# EAGLE design Adafruit_MAX31855 v2 (EAGLE 6.3)
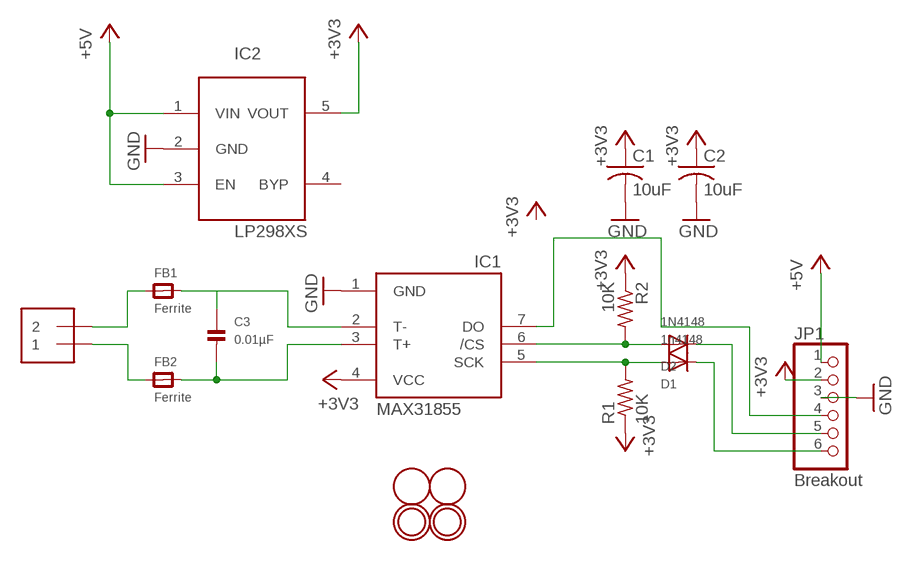
[diagram p0: schematic, sheet 1]

## Parts
C1  10uF  C-USC0805K  [C0805K]
C2  10uF  C-USC0805K  [C0805K]
C3  0.01µF  CAP_CERAMIC_0805  [_0805]
D1  1n4148  DIODESOD-323F  [SOD-323F]
D2  1N4148  DIODESOD-323F  [SOD-323F]
FB1  Ferrite  FERRITE_0805  [_0805]
FB2  Ferrite  FERRITE_0805  [_0805]
IC1  MAX31855  MAX6675  [SO08]
IC2  LP298XS  [SOT23-5L]
J1  1X2-3.5MM  [1X2-3.5MM]
JP1  Breakout  HEADER-1X676MIL  [1X06_ROUND_76]
R1  10K  R-US_R0805  [R0805]
R2  10K  R-US_R0805  [R0805]
U$1  FIDUCIAL  [FIDUCIAL_1MM]
U$2  FIDUCIAL  [FIDUCIAL_1MM]
U$4  MOUNTINGHOLE2.0  [MOUNTINGHOLE_2.0_PLATED]
U$5  MOUNTINGHOLE2.0  [MOUNTINGHOLE_2.0_PLATED]

## Nets
+3V3: C1.1 C2.1 IC1.4(VCC) IC2.5(VOUT) JP1.2 R1.1 R2.1
+5V: IC2.1(VIN) IC2.3(EN) JP1.1
CS: D2.A IC1.6(/CS) R2.2
DO: IC1.7(DO) JP1.4
GND: C1.2 C2.2 IC1.1(GND) IC2.2(GND) JP1.3
N$1: FB1.1 J1.2
N$2: D2.C JP1.5
N$3: D1.C JP1.6
N$4: C3.1 FB1.2 IC1.2(T-)
N$5: FB2.1 J1.1
N$6: C3.2 FB2.2 IC1.3(T+)
SCK: D1.A IC1.5(SCK) R1.2
Unconnected: IC2.4(BYP)

## Library data of the parts
C1 C2 = adafruit:C-US: CAPACITOR, American symbol
C3 = microbuilder:CAP_CERAMIC: Ceramic Capacitors 0402 - 0402 Surface Mount Capacitors 16pF 50V 5% [Digikey: 445-4899-2-ND] 18pF 50V 5% [Digikey: 490-1281-2-ND] 22pF 50V 5% [Digikey: 490-1283-2-ND] 68pF 50V 5% [Digikey: 490-1289-2-ND] 0.1uF 10V 10% [Digikey: 490-1318-2-ND] 1.0uF 6.3V 10% [Digikey: 490-1320-2-ND] 0603 - 0603 Surface Mount Capacitors 16 pF 50V 5% [Digikey: 445-5051-2-ND] 22 pF 50V [Digikey: PCC220ACVTR-ND] 33 pF 50V 5% [Digikey: 490-1415-1-ND] 56pF 50V 5% [Digikey: 490-1421-1-ND] 220pF 50V 5% [Digikey: 445-1285-1-ND] 680 pF 50V 2200 pF 50V 5% C0G [Digikey: 445-1297-1-ND] 5600 pF 100V 5% X7R [Digikey: 478-3711-1-ND] 0.1 µF 25V 10% [Digikey: PCC2277TR-ND] 0.22 µF 16V 10% X7R [Digikey: 445-1318-1-ND] 1.0 µF 25V 10% [Digikey: 445-5146-2-ND] 0603 - RF Specific 3pF 250V +/-0.1pF RF [Digikey: 712-1347-1-ND] 18 pF 250V 5% [Digikey: 478-3505-1-ND or 712-1322-1-ND] 56 pF 250V 5% C0G RF [Digikey: 490-4867-1-ND] 68 pF 250V RF [Digikey: 490-4868-1-ND] 0805 - 0805 Surface Mount Capacitors 220 pF 250V 2% RF Ceramic Capacitor [Digikey: 712-1398-1-ND] 1000 pF 50V 2% NP0 Ceramic Capacitor [Digikey: 478-3760-1-ND] 0.1 µF 25V 10% Ceramic Capacitor [Digikey: PCC1828TR-ND] 1.0 µF 16V 10% Ceramic Capacitor[Digikey: 490-1691-2-ND] 10.0 µF 10V 10% Ceramic Capacitor[Digikey: 709-1228-1-ND] 10.0 uF 16V 10% Ceramic Capacitor [Digikey: 478-5165-2-ND] 47 uF 6.3V 20% Ceramic Capacitor [Digikey: 587-1779-1-ND or 399-5506-1-ND] 1206 - 1206 Surface Mount Capacitors 47uF 10V 20% Ceramic Capacitor [Digikey: 490-5528-1-ND or 399-5508-1-ND or 445-6010-1-ND] 100uF 6.3V -20%, +80% Y5V Ceramic Capacitor (Digikey: 490-4512-1-ND, Mouser: 81-GRM31CF50J107ZE1L)
D1 D2 = adafruit:DIODE: Diode SMADIODE - SMA Surface Mount Package 20V 1A Schottky Diode Digikey: 641-1014-6-ND DO-1N4148 - Through Hole Small Current Diode SOD-123 20V 1 A (.5mV Vf) Schottky Diode - Digikey: MBRX120TPMSCT-ND SOD-323 10V 570mA (.38mV Vf, 3ns) Schottky Diode - Digikey: ZLLS410CT-ND SOD-523 30V 30mA Schottky Diode (RB751S-40TE61) - Digikey: RB751S-40TE61CT-ND SOT23-R/W - SOT23 Package (R = Solder Paste/Reflow Ovens, W = Hand-Soldering) BAT54Film 40V 300mA - Digikey: 497-7162-1-ND
FB1 FB2 = microbuilder:FERRITE: Ferrite Bead 0603 MMZ1608B121C - 120 Ohm @ 100MHz, 600mA, 0.15 Ohm DC Resistance - Digikey: 445-2164-1-ND BK1608HW121-T - 120 Ohm, 600mA Ferrite Chip - Digikey: 587-1876-2-ND 0805 HZ0805B272R-10 - 2.7K Ohm @ 100MHz, 200mA, 0.8 Ohm DC Resistance - Digikey: 240-2504-1-ND (see also Murata BLM21BD272SN1L) MMZ2012Y152B - 1.5K Ohm @ 100MHz, 500mA, 0.4 Ohm DC Resistance - Digikey: 445-1560-1-ND - Mainly for high frequency (80-400MHz) MMZ2012R102A - 1K Ohm @ 100MHz, 500mA, 0.3 Ohm DC Resistance - Digikey: 445-1555-2-ND - More general purpose (10-200MHz)
IC1 = adafruit:MAX6675
IC2 = adafruit:LP298X
J1 = adafruit:1X2: 3.5mm Terminal block http://www.ladyada.net/library/pcb/eaglelibrary.html
JP1 = microbuilder:HEADER-1X6: PIN HEADER
R1 R2 = adafruit:R-US_: RESISTOR, American symbol
U$1 U$2 = adafruit:FIDUCIAL: For use by pick and place machines to calibrate the vision/machine, 1mm By microbuilder.eu
U$4 U$5 = microbuilder:MOUNTINGHOLE: Mounting Hole

## Board
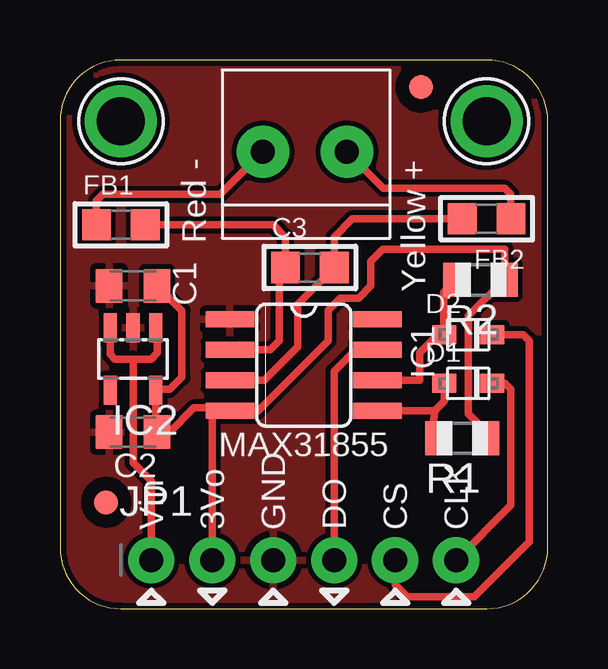
[diagram p1: board, top side]
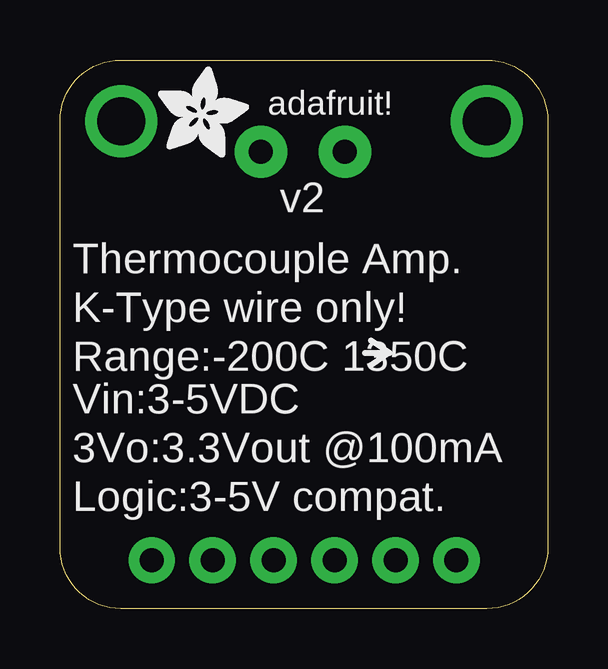
[diagram p2: board, bottom side, seen from below]

Size 20.33 x 22.86 mm. Coordinates in mm from the lower left corner, seen from the top.
Outline: 20.32,20.32 arc90 17.79,22.86 2.54,22.86 arc90 0,20.32 0,2.54 arc90 2.54,0 17.79,0 arc90 20.32,2.54 20.32,20.32
Copper layers (1*16): Top 0.035mm / dielectric 1.5mm / Bottom 0.035mm
Design rules "default": minimum track width 10mil, minimum drill 19mil, track to track 8mil, track to pad 8mil, pad to pad 8mil, via to via 8mil, smd to smd 8mil, copper to edge 10mil, drill to drill 8mil, minimum pad ring 10mil, minimum via ring 8mil, stop-mask expansion 4mil, vias tented up to drill 21mil, thermal gap 10mil

### Footprints (pad centres in the part's own frame; a part is rotated, then mirrored left to right if it is on the bottom)
C0805K = smd 1.1 x 1.4: 1 -1,0; 2 1,0
_0805 = smd 1.2 x 1.3: 1 -1.016,0; 2 1.016,0
SOD-323F = smd 1 x 0.8: A -1,0; C 1,0
SO08 = smd 0.66 x 2.032: 1 -1.905,-3.073; 2 -0.635,-3.073; 3 0.635,-3.073; 4 1.905,-3.073; 5 1.905,3.073; 6 0.635,3.073; 7 -0.635,3.073; 8 -1.905,3.073
SOT23-5L = smd 0.55 x 1.2: 1 -0.95,-1.3; 2 0,-1.3; 3 0.95,-1.3; 4 0.95,1.3; 5 -0.95,1.3
1X2-3.5MM = drill 1 pad 2.184: 1 1.8,0; 2 -1.7,0
1X06_ROUND_76 = drill 1 pad 1.93: 1 -6.35,0; 2 -3.81,0; 3 -1.27,0; 4 1.27,0; 5 3.81,0; 6 6.35,0
R0805 = smd 1.1 x 1.4: 1 -1,0; 2 1,0
FIDUCIAL_1MM = smd 1 x 1: 1 0,0
MOUNTINGHOLE_2.0_PLATED = drill 2 pad 3: P$1 0,0

### Placement (x,y rotation side)
C1  3.04,13.45 180 top
C2  3.04,7.35 180 top
C3  10.41,14.21 0 top
D1  17.01,9.39 0 top
D2  17.01,11.42 0 top
FB1  2.54,15.99 0 top
FB2  17.78,16.24 180 top
IC1  10.15,10.15 270 top
IC2  3.04,10.4 180 top
J1  10.15,19.04 0 top
JP1  10.15,2.02 0 top
R1  16.76,7.1 180 top
R2  17.52,13.7 180 top
U$1  15.03,21.73 0 top
U$2  1.93,4.43 0 top
U$4  17.78,20.31 0 top
U$5  2.54,20.31 0 top
U$6  [ADAFRUIT_3.5MM]  16.25,18.78 0 bottom

### Tracks (layer width: path | path; a pad name or v marks a point on that pad's centre or on a via)
+3V3
  Top 0.305: R1.1 17.78,7.35 17.01,8.12 17.01,12.2 R2.1 18.54,13.72 18.54,14.97 13.46,14.97 12.95,14.47 12.95,13.45 12.44,12.94 11.68,12.94 11.17,12.43 11.17,11.16 8.25,8.24 IC1.4 7.08,8.37 | 7.08,8.37 7.11,8.37 | 6.34,8.37 7.08,8.37 | 6.34,8.37 5.58,8.37 4.57,7.35 C2.1 | C2.1 3.81,7.35 | C2.1 4.04,7.59 4.06,7.61 3.99,7.67 IC2.5 4.02,9.13 4.57,9.13 5.08,9.64 5.08,12.42 C1.1 | JP1.2 6.34,8.37
+5V
  Top 0.305: IC2.3 2.09,10.59 2.28,10.4 3.04,10.4 | 3.04,10.4 3.81,10.4 4.06,10.66 4.06,11.42 4.02,11.67 IC2.1 | 3.04,10.4 3.04,6.08 3.81,5.32 JP1.1
CS
  Top 0.305: IC1.6 14.98,9.51 14.98,10.66 15.74,11.42 D2.A 16,11.43 16,13.18 R2.2
DO
  Top 0.305: JP1.4 11.42,9.89 12.44,10.91 13.46,10.91 13.33,10.78 IC1.7
GND
  pour Top: -0.26,22.85 -0.26,-0.27 20.82,-0.27 20.82,22.85
N$1
  Top 0.305: FB1.1 1.52,17.01 1.77,17.26 6.68,17.26 J1.2
N$2
  Top 0.305: D2.C 19.3,11.42 19.55,11.16 19.55,2.78 17.27,0.5 14.47,0.5 13.96,1 JP1.5
N$3
  Top 0.305: D1.C 18.54,9.39 18.79,9.13 18.79,4.31 JP1.6
N$4
  Top 0.305: FB1.2 8.88,15.99 9.39,15.48 C3.1 9.14,13.96 9.14,11.16 8.76,10.78 IC1.2
N$5
  Top 0.305: FB2.1 18.79,17.26 18.54,17.51 13.48,17.51 J1.1
N$6
  Top 0.305: IC1.3 8.5,9.51 9.9,10.91 9.9,12.69 C3.2 11.42,15.48 12.19,16.24 FB2.2
SCK
  Top 0.305: R1.2 15.49,7.1 15.62,8.24 | 15.62,8.24 IC1.5 | D1.A 16.01,8.64 15.62,8.24

### Text on the board
tPlace: Red - | Yellow + | MAX31855 | Vin | 3Vo | GND | DO | CS | CLK
bPlace: adafruit! | v2 | Thermocouple Amp. | K-Type wire only! | Range:-200C 1350C | Vin:3-5VDC | 3Vo:3.3Vout @100mA | Logic:3-5V compat.